# EAGLE board headset_br (EAGLE 6.5.0), part 1 of 2
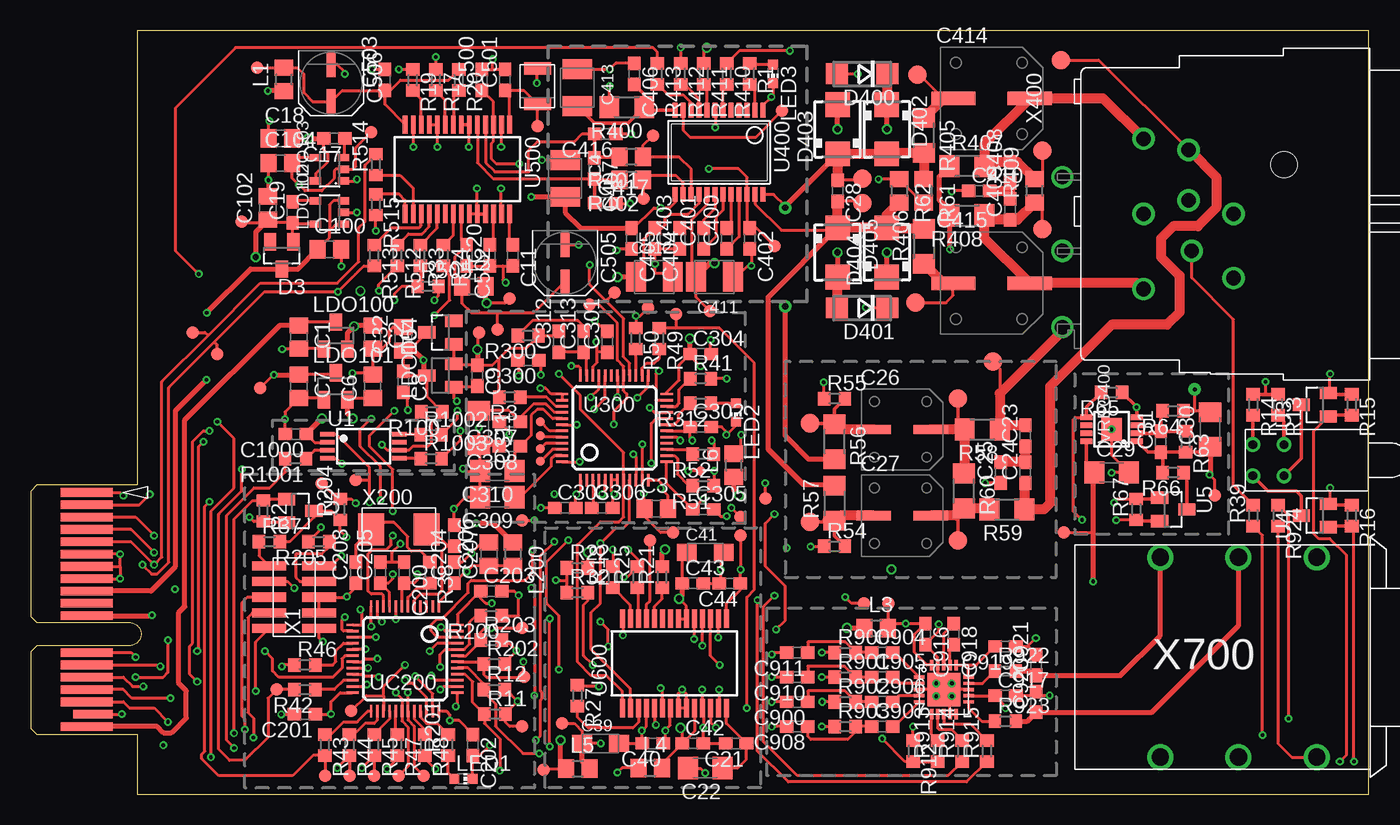
[diagram p10: board, top side]
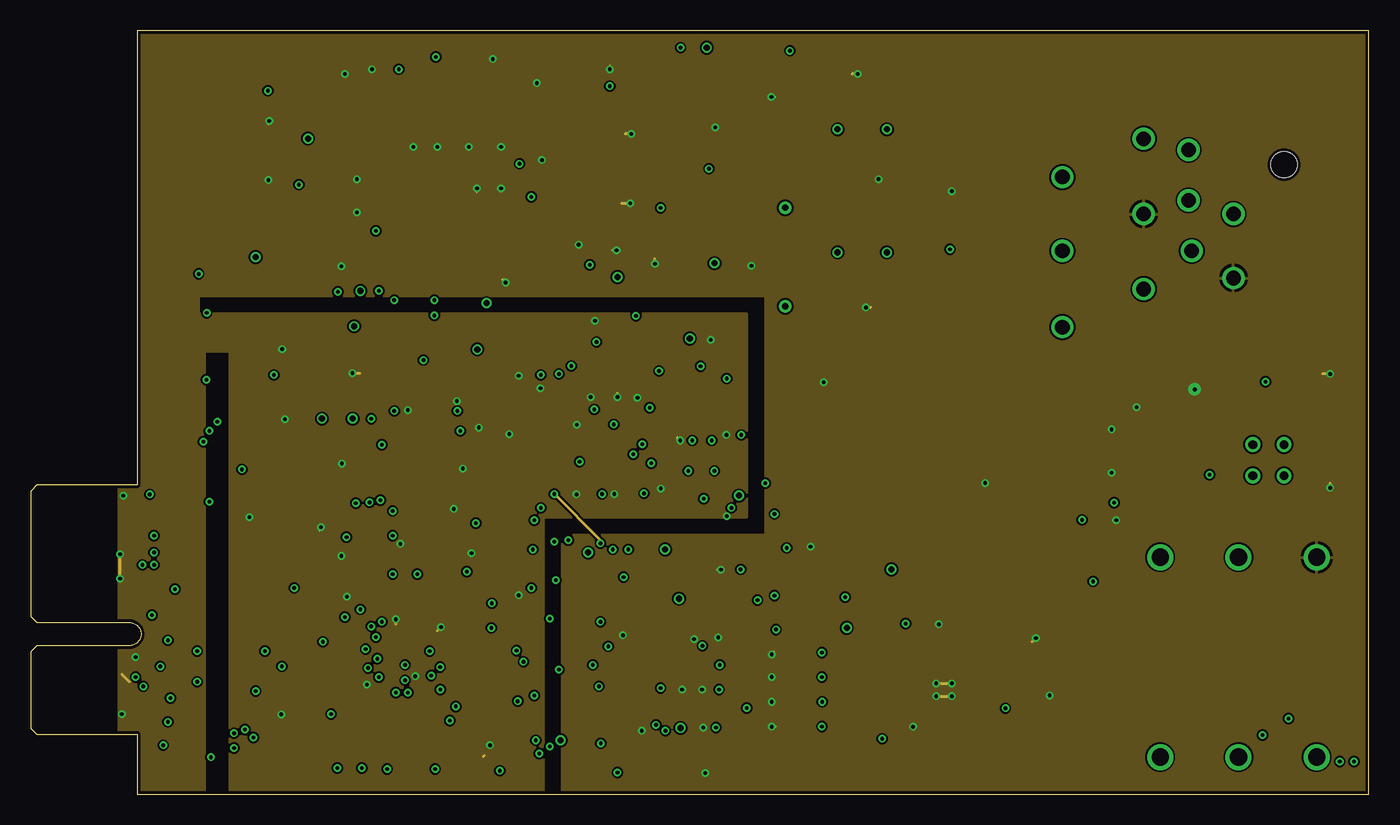
[diagram p11: board, inner layer GND]
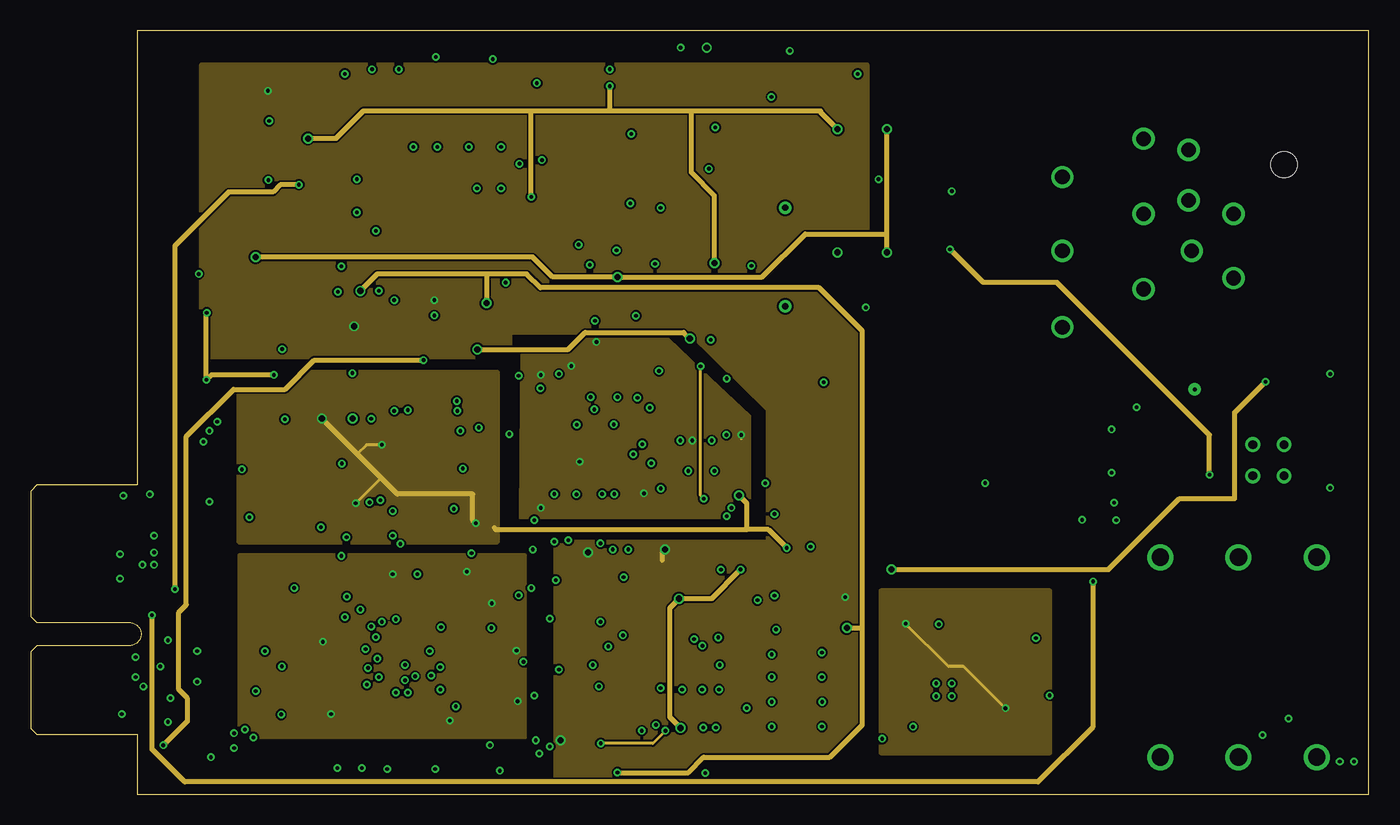
[diagram p12: board, inner layer VCC]
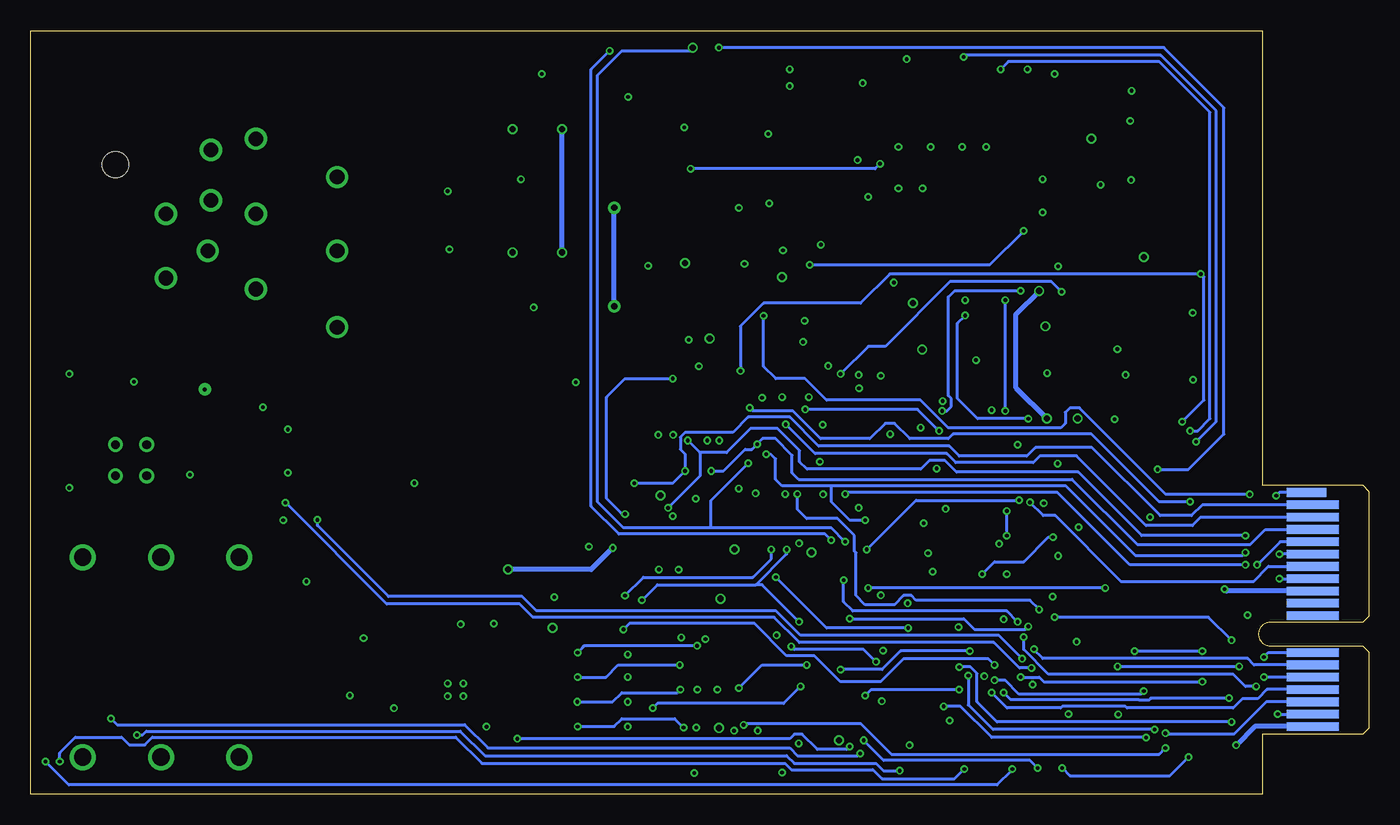
[diagram p13: board, bottom side, seen from below]

Size 108.64 x 62 mm. Coordinates in mm from the lower left corner, seen from the top.
Outline: 8.63,27 8.63,62 108.64,62 108.64,0 8.63,0 8.63,3
Copper layers ((1*2)+(15*16)): Top 0.035mm / dielectric 0.2mm / GND 0.035mm / dielectric 1mm / VCC 0.035mm / dielectric 0.2mm / Bottom 0.035mm
Design rules "Fusion_eagle_rule_v1.1 *": minimum track width 6mil, minimum drill 12mil, track to track 6mil, track to pad 6mil, pad to pad 6mil, via to via 6mil, smd to smd 0mil, copper to edge 10mil, drill to drill 10mil, minimum pad ring 10mil, minimum via ring 6mil, stop-mask expansion 2mil, vias tented up to drill 100mil, thermal gap 10mil

## Footprints (pad centres in the part's own frame; a part is rotated, then mirrored left to right if it is on the bottom)
C0805 = smd 1.3 x 1.5: 1 -0.95,0; 2 0.95,0
SMC_B = smd 1.6 x 2.4: + -1.5,0; - 1.5,0
C0603 = smd 1.1 x 1: 1 -0.85,0; 2 0.85,0
C1206 = smd 1.6 x 1.8: 1 -1.4,0; 2 1.4,0
PANASONIC_FK_V_SIZE_D = smd 2.8 x 0.75: N -2.3,0; P 2.3,0
SMC_A = smd 1.6 x 1.4: + -1.5,0; - 1.5,0
PANASONIC_FK_V_SIZE_F = smd 3.6 x 1.1: M -3.1,0; P 3.1,0
VISHAY_TR3_SIZE_B = smd 1 x 2.2: M -1.45,0; P 1.45,0
KEMET_EDK_5MM = smd 2 x 0.75: M -1.5,0; P 1.5,0
SOT23 = smd 1 x 1.4: 1 -0.95,-1.1; 2 0.95,-1.1; 3 0,1.1
DO214AC = smd 1.8 x 1.7: A 2.05,0; C -2.05,0
SMA = smd 2 x 2: A 2,0; C -2,0
MENTOR-2LED = drill 0.7: A_BOTTOM 0,1.27; A_TOP -2.54,1.27; C_BOTTOM 0,-1.27; C_TOP -2.54,-1.27
R0805 = smd 1.3 x 1.5: 1 -0.95,0; 2 0.95,0
SOT23-5 = smd 0.6 x 0.9: 1 -0.95,-1.15; 2 0,-1.15; 3 0.95,-1.15; 4 0.95,1.15; 5 -0.95,1.15
CHIP-LED0603 = smd 0.8 x 0.8: A 0,-0.75; C 0,0.75
PCIE-36-EDGE = smd 0.7 x 3.2 bottom: A1 -11.5,-3.6 | smd 0.7 x 4.2 bottom: A2 -10.5,-4.1; A3 -9.5,-4.1; A4 -8.5,-4.1; A5 -7.5,-4.1; A6 -6.5,-4.1; A7 -5.5,-4.1; A8 -4.5,-4.1; A9 -3.5,-4.1; A10 -2.5,-4.1; A11 -1.5,-4.1; A12 1.5,-4.1; A13 2.5,-4.1; A14 3.5,-4.1; A15 4.5,-4.1; A16 5.5,-4.1; A17 6.5,-4.1; A18 7.5,-4.1 | smd 0.7 x 4.2: B1 -11.5,-4.1; B2 -10.5,-4.1; B3 -9.5,-4.1; B4 -8.5,-4.1; B5 -7.5,-4.1; B6 -6.5,-4.1; B7 -5.5,-4.1; B8 -4.5,-4.1; B9 -3.5,-4.1; B10 -2.5,-4.1; B11 -1.5,-4.1; B12 1.5,-4.1; B13 2.5,-4.1; B14 3.5,-4.1; B15 4.5,-4.1; B16 5.5,-4.1; B18 7.5,-4.1 | smd 0.7 x 3.2: B17 6.5,-3.6
R0603 = smd 1 x 1.1: 1 -0.85,0; 2 0.85,0
R1206 = smd 1.6 x 1.803: 1 -1.422,0; 2 1.422,0
TESTPAD_SMALL = smd 1 x 1: P$1 0,0
TESTPAD = smd 1.5 x 1.5: P$1 0,0
TESTPAD_EXTRA_SMALL = smd 0.75 x 0.75: P$1 0,0
TSSOP8 = smd 1.2 x 0.35: 1 -2.925,0.975; 2 -2.925,0.325; 3 -2.925,-0.325; 4 -2.925,-0.975; 5 2.925,-0.975; 6 2.925,-0.325; 7 2.925,0.325; 8 2.925,0.975
LQFP48 = smd 0.2 x 1: 1 -2.75,-4.25; 2 -2.25,-4.25; 3 -1.75,-4.25; 4 -1.25,-4.25; 5 -0.75,-4.25; 6 -0.25,-4.25; 7 0.25,-4.25; 8 0.75,-4.25; 9 1.25,-4.25; 10 1.75,-4.25; 11 2.25,-4.25; 12 2.75,-4.25; 25 2.75,4.25; 26 2.25,4.25; 27 1.75,4.25; 28 1.25,4.25; 29 0.75,4.25; 30 0.25,4.25; 31 -0.25,4.25; 32 -0.75,4.25; 33 -1.25,4.25; 34 -1.75,4.25; 35 -2.25,4.25; 36 -2.75,4.25 | smd 1 x 0.2: 13 4.25,-2.75; 14 4.25,-2.25; 15 4.25,-1.75; 16 4.25,-1.25; 17 4.25,-0.75; 18 4.25,-0.25; 19 4.25,0.25; 20 4.25,0.75; 21 4.25,1.25; 22 4.25,1.75; 23 4.25,2.25; 24 4.25,2.75; 37 -4.25,2.75; 38 -4.25,2.25; 39 -4.25,1.75; 40 -4.25,1.25; 41 -4.25,0.75; 42 -4.25,0.25; 43 -4.25,-0.25; 44 -4.25,-0.75; 45 -4.25,-1.25; 46 -4.25,-1.75; 47 -4.25,-2.25; 48 -4.25,-2.75
SSOP24 = smd 0.4 x 1.2: 1 -3.575,-3.42; 2 -2.925,-3.42; 3 -2.275,-3.42; 4 -1.625,-3.42; 5 -0.975,-3.42; 6 -0.325,-3.42; 7 0.325,-3.42; 8 0.975,-3.42; 9 1.625,-3.42; 10 2.275,-3.42; 11 2.925,-3.42; 12 3.575,-3.42; 13 3.575,3.42; 14 2.925,3.42; 15 2.275,3.42; 16 1.625,3.42; 17 0.975,3.42; 18 0.325,3.42; 19 -0.325,3.42; 20 -0.975,3.42; 21 -1.625,3.42; 22 -2.275,3.42; 23 -2.925,3.42; 24 -3.575,3.42
SSOP28 = smd 0.4 x 1.5: 1 -4.225,-3.625; 2 -3.575,-3.625; 3 -2.925,-3.625; 4 -2.275,-3.625; 5 -1.625,-3.625; 6 -0.975,-3.625; 7 -0.325,-3.625; 8 0.325,-3.625; 9 0.975,-3.625; 10 1.625,-3.625; 11 2.275,-3.625; 12 2.925,-3.625; 13 3.575,-3.625; 14 4.225,-3.625; 15 4.225,3.625; 16 3.575,3.625; 17 2.925,3.625; 18 2.275,3.625; 19 1.625,3.625; 20 0.975,3.625; 21 0.325,3.625; 22 -0.325,3.625; 23 -0.975,3.625; 24 -1.625,3.625; 25 -2.275,3.625; 26 -2.925,3.625; 27 -3.575,3.625; 28 -4.225,3.625
TPA6130A2-QFN = smd 0.85 x 0.28: P1 -2,1; P2 -2,0.5; P3 -2,0; P4 -2,-0.5; P5 -2,-1; P11 2,-1; P12 2,-0.5; P13 2,0; P14 2,0.5; P15 2,1 | smd 0.28 x 0.85: P6 -1,-2; P7 -0.5,-2; P8 0,-2; P9 0.5,-2; P10 1,-2; P16 1,2; P17 0.5,2; P18 0,2; P19 -0.5,2; P20 -1,2 | smd 2.7 x 2.7: POWERPAD 0,0
TPS7A41 = smd 0.45 x 1: 1 -0.975,-2.05; 2 -0.325,-2.05; 3 0.325,-2.05; 4 0.975,-2.05; 5 0.975,2.05; 6 0.325,2.05; 7 -0.325,2.05; 8 -0.975,2.05 | smd 1.85 x 1.7: POWERPAD 0,0
FTS-105-01-X-DV = smd 0.74 x 2.79: 1 -2.54,-2.032; 2 -2.54,2.032; 3 -1.27,-2.032; 4 -1.27,2.032; 5 0,-2.032; 6 0,2.032; 7 1.27,-2.032; 8 1.27,2.032; 9 2.54,-2.032; 10 2.54,2.032
ABRACON_ABM7 = smd 2.1 x 2.6: P$1 -2.25,0; P$2 2.25,0
NCJ10FI-H-0 = drill 1.2: 1 -6.1,-18.4; 2 6.1,-18.4; 3 0,-18.4; G 0,-11.1; GN -1.1,-14.75; R -5.2,-14.75; RS -3,-25; S 5.2,-11.1; SS 3,-14.5; T 9.2,-25; TS 3,-25 | hole 2.1: -4,-7
NMJ6HHD2 = drill 1.4 pad 1.93: R -10.7,8.115; RN -10.7,-8.115; S -4.35,8.115; SN -4.35,-8.115; T -17.05,8.115; TN -17.05,-8.115

## Placement (x,y rotation side)
C1  10uF/10V  [C0805]  21.76,37.12 270 top
C2  10uF/10V  [C0805]  27.76,37.12 270 top
C3  10uF/10V  [C0805]  50.78,23.18 0 top
C4  4,7uF/TANT  [SMC_B]  43.38,50 270 top
C6  10uF/10V  [C0805]  27.76,33.12 90 top
C7  10uF/10V  [C0805]  21.76,33.12 270 top
C8  1uF  [C0603]  30.26,33.5 270 top
C9  1uF  [C0603]  36.26,34 270 top
C11  100nF/X7R  [C0603]  39.13,43.75 270 top
C17  10nF/C0G  [C0603]  24.63,53.25 180 top
C18  10uF/10V/X7R  [C0805]  20.26,53.25 0 top
C19  10nF/C0G  [C0603]  21.26,47.25 90 top
C20  100nF/X7R  [C0603]  37.26,43.75 90 top
C21  100nF  [C0603]  57.26,4.12 180 top
C22  10uF/16V  [C1206]  54.76,2.12 180 top
C23  470pF  [C0603]  80.76,29.12 90 top
C24  470pF  [C0603]  80.76,26.12 90 top
C25  47pF  [C0603]  78.76,26.12 90 top
C26  47uF/25V  [PANASONIC_FK_V_SIZE_D]  70.76,29.62 0 top
C27  47uF/25V  [PANASONIC_FK_V_SIZE_D]  70.76,22.62 0 top
C28  470pF  [C0603]  65.51,49 270 top
C29  10uF/50V/X5R  [C1206]  87.76,26.12 0 top
C30  10uF/50V/X5R  [C1206]  95.76,29.62 90 top
C31  10nF/50V  [C0603]  91.76,28.62 90 top
C32  10uF/10V  [C0805]  30.26,37 90 top
C39  10uF  [SMC_A]  46.26,4.12 0 top
C40  100nF  [C0603]  50.51,4.12 180 top
C41  10uF  [SMC_A]  54.76,19.62 0 top
C42  100nF  [C0603]  53.76,4.12 0 top
C43  100nF  [C0603]  53.76,17.12 0 top
C44  100nF  [C0603]  56.76,17.12 180 top
C100  10uF/10V  [C0805]  24.26,44.25 0 top
C102  10uF/10V/X7R  [C0805]  19.26,47.6 90 top
C104  10uF/10V  [C0805]  20.26,51.25 0 top
C200  100nF  [C0603]  30.31,18 270 top
C201  100nF  [C0603]  22.26,6.5 180 top
C202  100nF  [C0603]  35.88,4 270 top
C203  100nF  [C0603]  37.38,16.5 0 top
C204  100nF  [C0603]  34.38,18 90 top
C205  100nF  [C0603]  28.38,18 90 top
C206  10uF  [C0805]  37.21,19.5 90 top
C207  18pF  [C0603]  34.38,21 270 top
C208  18pF  [C0603]  26.38,18 90 top
C300  100nF  [C0603]  40.38,35.25 180 top
C301  100nF  [C0603]  46.81,36.75 90 top
C302  100nF  [C0603]  54.38,29.82 0 top
C303  100nF  [C0603]  43.38,23.25 0 top
C304  100nF  [C0603]  54.38,35.75 0 top
C305  100nF  [C0603]  54.61,23.12 0 top
C306  100nF  [C0603]  46.38,23.25 0 top
C307  100nF  [C0603]  38.88,30.25 180 top
C308  100nF  [C0603]  38.88,28.25 180 top
C309  10uF  [C1206]  37.88,24.12 180 top
C310  10uF  [C1206]  37.88,26.25 180 top
C311  10uF  [C1206]  36.38,29.75 270 top
C312  3,3nF  [C0603]  42.88,36.75 90 top
C313  56nF  [C0603]  44.88,36.75 90 top
C400  1uF/X7R  [C0603]  56.51,45.12 90 top
C401  1uF/X7R  [C0603]  54.63,45.12 90 top
C402  100nF/X7R  [C0603]  58.38,45.12 270 top
C403  100nF/X7R  [C0603]  52.68,45.12 90 top
C404  100nF/X7R  [C0603]  50.66,45.12 270 top
C405  100nF/X7R  [C0603]  48.78,45.12 270 top
C406  100nF/X7R  [C0603]  49.01,58.5 270 top
C407  2,7nF  [C0603]  45.76,50.83 270 top
C408  100pF  [C0603]  79.51,50.5 90 top
C409  100pF  [C0603]  79.51,47.5 90 top
C410  0R  [C0603]  77.01,49 0 top
C411  4,7uF  [SMC_B]  55.51,42 180 top
C412  4,7uF/TANT  [SMC_B]  50.63,42 0 top
C413  4,7uF/TANT  [SMC_B]  44.38,57.38 270 top
C414  47uF  [PANASONIC_FK_V_SIZE_F]  78.01,56.5 0 top
C415  47uF  [PANASONIC_FK_V_SIZE_F]  78.01,41.5 0 top
C416  100pF  [C0603]  46.63,53.62 180 top
C417  100pF  [C0603]  46.63,48 0 top
C500  100nF/X7R  [C0603]  36.63,58 90 top
C501  100nF/X7R  [C0603]  38.51,58 90 top
C502  100nF/X7R  [C0603]  35.38,43.75 270 top
C503  100nF/X7R  [C0603]  28.76,58 90 top
C504  47uF  [VISHAY_TR3_SIZE_B]  41.13,57.5 270 top
C505  47uF  [KEMET_EDK_5MM]  43.38,43.12 270 top
C506  47uF  [KEMET_EDK_5MM]  24.38,57.75 270 top
C900  220p/NP0/50V/5%  [C0603]  62.23,7.5 180 top
C904  2,2uF/10V  [C0603]  69.14,11.5 0 top
C905  2,2uF/10V  [C0603]  69.14,9.5 0 top
C906  2,2uF/10V  [C0603]  69.14,7.5 0 top
C907  2,2uF/10V  [C0603]  69.14,5.5 0 top
C908  220p/NP0/50V/5%  [C0603]  62.23,5.5 180 top
C910  220p/NP0/50V/5%  [C0603]  62.23,9.5 180 top
C911  220p/NP0/50V/5%  [C0603]  62.23,11.5 180 top
C916  1uF  [C0603]  72.64,13 270 top
C917  1uF  [C0603]  79.14,8 0 top
C918  1uF  [C0603]  74.94,13 270 top
C919  2,2uF  [C0603]  79.14,12 180 top
C920  270pf/n.b.  [C0603]  81.64,7.5 90 top
C921  270pf/n.b.  [C0603]  81.64,10.5 90 top
C1000  1uF  [C0603]  21.51,29.25 180 top
D3  BAS40SOT23  [SOT23]  20.38,43.75 180 top
D5  BAS40SOT23  [SOT23]  33.26,37.5 90 top
D400  [DO214AC]  67.51,58.5 180 top
D401  [DO214AC]  67.51,39.5 180 top
D402  MBRA120ET3G  [SMA]  69.51,54 270 top
D403  MBRA120ET3G  [SMA]  65.51,54 90 top
D404  MBRA120ET3G  [SMA]  69.51,44 90 top
D405  MBRA120ET3G  [SMA]  65.51,44 270 top
DUOLED  MENTOR-2LEDRED/GREEN  [MENTOR-2LED]  101.76,27.12 0 top
L1  [R0805]  20.56,58.05 90 top
L2  [R0805]  35.98,41.25 0 top
L3  tbd  [R0805]  68.64,13.5 0 top
L4  [R0805]  50.31,2.12 0 top
L5  [R0805]  44.41,2.08 0 top
L6  tbd  [R0805]  57.09,26.7 90 top
L200  tbd  [R0805]  39.13,19.5 270 top
LDO100  MCP1702T-3302E  [SOT23]  24.76,37.25 0 top
LDO101  MCP1702T-5002E  [SOT23]  24.76,33.12 0 top
LDO102  LP2985-50  [SOT23-5]  24.26,47.25 90 top
LDO103  LT1964-5  [SOT23-5]  24.26,50.75 90 top
LDO104  MCP1702T-1802E  [SOT23]  33.26,34 90 top
LED1  GREEN  [CHIP-LED0603]  35.13,1.25 270 top
LED2  GREEN  [CHIP-LED0603]  57.26,31 180 top
LED3  GREEN  [CHIP-LED0603]  60.26,58.5 180 top
MODULE_CON  [PCIE-36-EDGE]  8.63,13 270 top
R1  1K  [R0603]  58.38,58.5 270 top
R2  10K  [R0603]  18.88,23 270 top
R3  10K  [R0603]  38.88,32.25 180 top
R11  10K  [R0603]  37.69,6.5 0 top
R12  10K  [R0603]  37.63,8.5 0 top
R13  tbd  [R0603]  101.26,31.62 270 top
R14  tbd  [R0603]  99.26,31.62 270 top
R15  10K  [R0603]  107.26,31.62 270 top
R16  10K  [R0603]  107.26,22.62 270 top
R17  100R  [R0603]  32.88,58 270 top
R18  100R  [R0603]  47.26,17.62 90 top
R19  100R  [R0603]  31.01,58 270 top
R20  10K  [R0603]  34.76,58 270 top
R21  10K  [R0603]  51.26,17.62 90 top
R22  10K  [R0603]  44.38,18.38 0 top
R24  100R  [R0603]  33.51,43.75 270 top
R25  100R  [R0603]  49.26,17.62 90 top
R27  100R  [R0603]  44.38,8 270 top
R32  100R  [R0603]  44.38,16.38 0 top
R33  100R  [R0603]  31.63,43.75 270 top
R37  475R  [R0603]  19.38,20.5 0 top
R38  0R  [R0603]  32.38,18 270 top
R39  1K  [R0603]  99.26,22.62 90 top
R41  100R  [R0603]  54.38,33.75 0 top
R42  100R  [R0603]  22.26,8.5 180 top
R43  100R  [R0603]  23.88,4 270 top
R44  100R  [R0603]  25.88,4 270 top
R45  100R  [R0603]  27.88,4 270 top
R46  100R  [R0603]  22.26,10.5 0 top
R47  100R  [R0603]  29.76,4 270 top
R48  100R  [R0603]  32.01,4 270 top
R49  100R  [R0603]  51.03,37 270 top
R50  100R  [R0603]  49.11,37 270 top
R51  100R  [R0603]  54.61,25.05 180 top
R52  100R  [R0603]  54.61,27.6 180 top
R54  47K  [R0603]  65.26,20.12 0 top
R55  47K  [R0603]  65.26,32.12 0 top
R56  9K09  [R1206]  65.26,28.62 270 top
R57  9K09  [R1206]  65.26,23.62 90 top
R58  1K10  [R1206]  77.26,29.62 180 top
R59  1K10  [R1206]  79.26,23.12 180 top
R60  267R  [R1206]  75.76,24.62 270 top
R61  1K21  [R0805]  72.51,49 270 top
R62  1K21  [R0805]  70.51,49 270 top
R63  44K/1%  [R0603]  93.76,28.62 270 top
R64  1K1/1%  [R0603]  92.76,31.12 180 top
R65  10K  [R0603]  87.76,32.62 180 top
R66  0R  [R0603]  92.76,26.12 180 top
R67  10K  [R0603]  89.76,23.12 90 top
R100  0R  [R0603]  32.56,31.05 180 top
R200  10K  [R0603]  37.38,14.5 180 top
R201  1K  [R0603]  33.88,4 90 top
R202  4K7  [R0603]  37.63,10.57 0 top
R203  4K7  [R0603]  37.38,12.5 0 top
R204  10K  [R0603]  25.13,23.12 90 top
R205  10K  [R0603]  23.38,20.5 180 top
R300  475R  [R0603]  40.38,37.25 180 top
R312  1K  [R0603]  54.38,31.75 180 top
R400  10R0  [R1206]  48.38,55.8 180 top
R401  40R2  [R0805]  48.76,51.75 180 top
R402  40R2  [R0805]  48.76,49.88 180 top
R405  10R0  [R1206]  72.51,53.5 270 top
R406  10R0  [R1206]  72.51,44.5 90 top
R407  6K81  [R1206]  76.01,51 0 top
R408  6K81  [R1206]  76.01,47 180 top
R409  n.b.  [R0805]  81.51,49 90 top
R410  100R  [R0603]  56.51,58.5 270 top
R411  100R  [R0603]  54.63,58.5 270 top
R412  100R  [R0603]  52.76,58.5 270 top
R413  100R  [R0603]  50.88,58.5 270 top
R505  10K  [R0603]  32.26,41.25 0 top
R512  100R  [R0603]  29.76,43.75 270 top
R513  100R  [R0603]  27.88,43.75 270 top
R514  100R  [R0603]  28.01,51.12 90 top
R515  100R  [R0603]  28.01,47.88 270 top
R900  20K/1%  [R0603]  66.14,11.5 0 top
R901  20K/1%  [R0603]  66.14,9.5 0 top
R902  20K/1%  [R0603]  66.14,7.5 0 top
R903  20K/1%  [R0603]  66.14,5.5 0 top
R912  10K  [R0603]  71.64,3.5 270 top
R913  100R  [R0603]  73.64,3.5 90 top
R914  100R  [R0603]  75.64,3.5 90 top
R915  100R  [R0603]  77.64,3.5 90 top
R922  0R  [R0603]  79.14,10 0 top
R923  0R  [R0603]  79.14,5.92 0 top
R924  1K  [R0603]  101.26,22.62 270 top
R1001  22R  [R0603]  21.51,27.25 180 top
R1002  22R  [R0603]  32.51,29.18 0 top
R1003  22R  [R0603]  32.51,27.25 0 top
TP1  TPS  [TESTPAD_SMALL]  50.26,20.62 0 top
TP2  TPS  [TESTPAD_SMALL]  61.01,55.5 270 top
TP3  TP  [TESTPAD]  82.14,52.25 0 top
TP4  TP  [TESTPAD]  82.14,45.88 0 top
TP5  TP  [TESTPAD]  71.98,58.45 0 top
TP6  TP  [TESTPAD]  71.84,39.92 0 top
TP7  TP  [TESTPAD]  67.51,48 0 top
TP8  TP  [TESTPAD]  67.51,50 0 top
TP9  TP  [TESTPAD]  78.14,35.12 0 top
TP10  TP  [TESTPAD]  83.64,59.62 0 top
TP11  TP  [TESTPAD]  75.26,32.12 0 top
TP12  TP  [TESTPAD]  75.26,20.62 0 top
TP13  TP  [TESTPAD]  63.26,22.12 0 top
TP14  TP  [TESTPAD]  63.26,30.12 0 top
TP15  TPXS  [TESTPAD_EXTRA_SMALL]  41.38,27.02 180 top
TP16  TPS  [TESTPAD_SMALL]  50.51,53.5 270 top
TP17  TPS  [TESTPAD_SMALL]  49.76,48.38 270 top
TP18  TPS  [TESTPAD_SMALL]  19.96,8.5 180 top
TP19  TPS  [TESTPAD_SMALL]  23.88,1.5 180 top
TP20  TPS  [TESTPAD_SMALL]  25.88,1.5 180 top
TP21  TPS  [TESTPAD_SMALL]  26.01,6.75 180 top
TP22  TPS  [TESTPAD_SMALL]  27.88,1.5 180 top
TP23  TPS  [TESTPAD_SMALL]  40.03,9.53 180 top
TP24  TPS  [TESTPAD_SMALL]  39.88,13.5 180 top
TP25  TPS  [TESTPAD_SMALL]  29.88,1.5 180 top
TP26  TPS  [TESTPAD_SMALL]  31.88,1.5 180 top
TP27  TPXS  [TESTPAD_EXTRA_SMALL]  41.38,28.07 180 top
TP28  TPXS  [TESTPAD_EXTRA_SMALL]  41.38,29.12 180 top
TP29  TPXS  [TESTPAD_EXTRA_SMALL]  41.38,30.25 180 top
TP30  TPS  [TESTPAD_SMALL]  67.64,15.5 0 top
TP36  TPS  [TESTPAD_SMALL]  45.38,39.75 0 top
TP40  TPS  [TESTPAD_SMALL]  47.38,40.75 0 top
TP41  TPS  [TESTPAD_SMALL]  52.38,39 0 top
TP42  TPS  [TESTPAD_SMALL]  23.63,25.25 0 top
TP43  TPS  [TESTPAD_SMALL]  36.38,37.5 0 top
TP44  TPS  [TESTPAD_SMALL]  41.63,2 0 top
TP45  TPS  [TESTPAD_SMALL]  38.88,40.25 0 top
TP46  TPS  [TESTPAD_SMALL]  17.13,46.5 0 top
TP47  TPS  [TESTPAD_SMALL]  55.13,39.25 0 top
TP48  TPS  [TESTPAD_SMALL]  18.63,33 0 top
TP49  TPS  [TESTPAD_SMALL]  27.63,53.75 0 top
TP50  TPS  [TESTPAD_SMALL]  96.14,24.25 0 top
TP51  TPS  [TESTPAD_SMALL]  52.13,21.25 0 top
TP52  TPS  [TESTPAD_SMALL]  39.88,5.5 0 top
TP53  TPS  [TESTPAD_SMALL]  60.38,44.5 0 top
TP54  TPS  [TESTPAD_SMALL]  18.38,59 0 top
TP55  TPS  [TESTPAD_SMALL]  37.88,37.75 0 top
TP56  TPS  [TESTPAD_SMALL]  41.13,54.25 0 top
TP57  TPS  [TESTPAD_SMALL]  43.13,5.75 0 top
TP58  TPS  [TESTPAD_SMALL]  57.63,21 0 top
TP59  TPS  [TESTPAD_SMALL]  69.64,15.5 0 top
TP1000  TPS  [TESTPAD_SMALL]  26.38,25.5 0 top
TP1001  TPS  [TESTPAD_SMALL]  13.13,37.5 0 top
TP1002  TPS  [TESTPAD_SMALL]  15.13,35.75 0 top
TP1003  TPXS  [TESTPAD_EXTRA_SMALL]  54.38,26.25 0 top
TP1004  TPS  [TESTPAD_SMALL]  39.88,22.25 0 top
TP1006  TPS  [TESTPAD_SMALL]  57.63,22.5 0 top
TP1007  TPS  [TESTPAD_SMALL]  59.63,24 0 top
TP1008  TPS  [TESTPAD_SMALL]  50.13,39.5 0 top
TP1009  TPS  [TESTPAD_SMALL]  83.89,21.25 0 top
U1  CDCLVC1103  [TSSOP8]  27.01,28.25 0 top
U2  2N7002  [SOT23]  21.88,23 270 top
U3  2N7002  [SOT23]  104.26,31.62 90 top
U4  2N7002  [SOT23]  104.26,22.62 90 top
U5  2N7002  [SOT23]  92.76,23.12 270 top
U300  ADAU1701/02ADAU1701JSTZ  [LQFP48]  47.38,29.75 0 top
U400  PGA2505  [SSOP24]  55.88,52.12 180 top
U500  PCM4202  [SSOP28]  34.63,50.75 180 top
U600  PCM1791A  [SSOP28]  52.26,10.62 0 top
U700  TPA6130A2  [TPA6130A2-QFN]  74.14,8.5 0 top
UC200  STM32F100XXLQFP48  [LQFP48]  30.38,11 180 top
VREG400  TPS7A41  [TPS7A41]  87.76,29.62 90 top
X1  JTAG  [FTS-105-01-X-DV]  21.38,16 90 top
X200  8MHz  [ABRACON_ABM7]  29.88,21.5 0 top
X400  NCJ10FI-H-0  [NCJ10FI-H-0]  108.76,47.12 270 top
X700  NMJ6HHD2  [NMJ6HHD2]  108.76,11.12 0 top